# Altium schematic sheet V1.0.SchDoc
size 109 x 76 mm
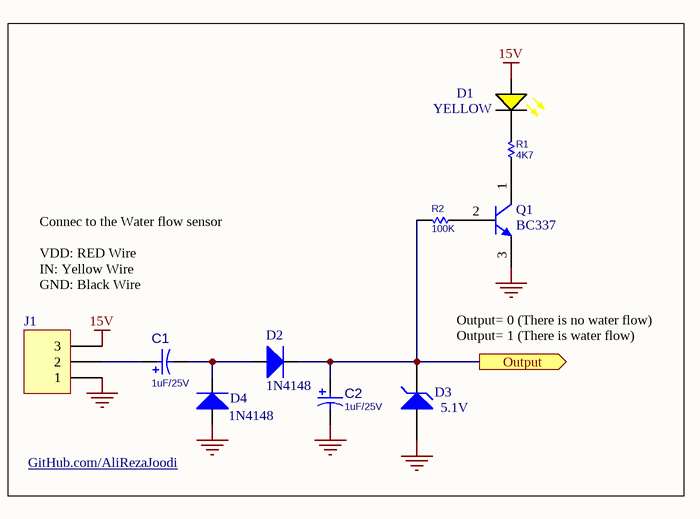
[diagram p0: V1.0.SchDoc]

## Parts
C1  1uF/25V  [C_THD_EL_(P2.54-D6-H11)]
C2  1uF/25V  [C_THD_EL_(P2.54-D6-H11)]
D1  YELLOW  [LED_THD_5MM_YELLOW]
D2  1N4148  [D_THD_AXIAL0.3_DO-35]
D3  5.1V  [D_THD_AXIAL0.3_DO-35]
D4  1N4148  [D_THD_AXIAL0.3_DO-35]
J1  J8  [Connector_Phoenix_3PIN_MSTB]  (value not drawn)
Q1  BC337  [TO92_3Pin_Form3]
R1  4K7  [R_THD_AXIAL0.4(1/4W)]
R2  100K  [R_THD_AXIAL0.4(1/4W)]

## Ports
Output (out)

## Nets
15V: D1.1(A) J1.3
GND: C2.2 D3.1(A) D4.1(A) J1.1 Q1.3(E)
Output: C2.1 D2.2(K) D3.2(K) R2.1 ; port Output
NetC1_1: C1.1 J1.2
NetC1_2: C1.2 D2.1(A) D4.2(K)
NetD1_2: D1.2(K) R1.1
NetQ1_1: Q1.1(C) R1.2
NetQ1_2: Q1.2(B) R2.2

## Notes on the sheet
- Connec to the Water flow sensor
  VDD: RED Wire
  IN: Yellow Wire
  GND: Black Wire
- Output= 0 (There is no water flow)
  Output= 1 (There is water flow)
- GitHub.com/AliRezaJoodi

## Library data of the parts
C1 C2 = Capacitor_Electrolytic: Capacitor, Electrolytic
D1 = LED_YELLOW: LED, Yellow; Manufacturer: Generic Components; Class I: Optoelectronic; Published: 8-Jun-2000; Revision: July-2002: Re-released for DXP Platform.; Publisher: Altium Limited; Class II: LED
D2 D4 = Diode: Default Diode; Manufacturer: Generic Components; Class I: Discrete; Class II: Diode - Switching; Published: 8-Jun-2000; Revision: July-2002: Re-released for DXP Platform.; Publisher: Altium Limited
D3 = D Zener: Zener Diode; Manufacturer: Generic Components; Class I: Discrete; Class II: Diode - Zener; Published: 8-Jun-2000; Revision: July-2002: Re-released for DXP Platform.; Publisher: Altium Limited
J1 = Header 3: Header, 3-Pin; Manufacturer: Generic Components; Class I: Connector; Revision: July-2002: Re-released for DXP Platform.; Publisher: Altium Limited
Q1 = Transistor_BJT_NPN: Transistor, BJT, NPN; Package Reference: TO-92A
R1 R2 = Resistor: Resistor,